# EAGLE design Hypex_PSU_v6 (EAGLE 6.5.0)
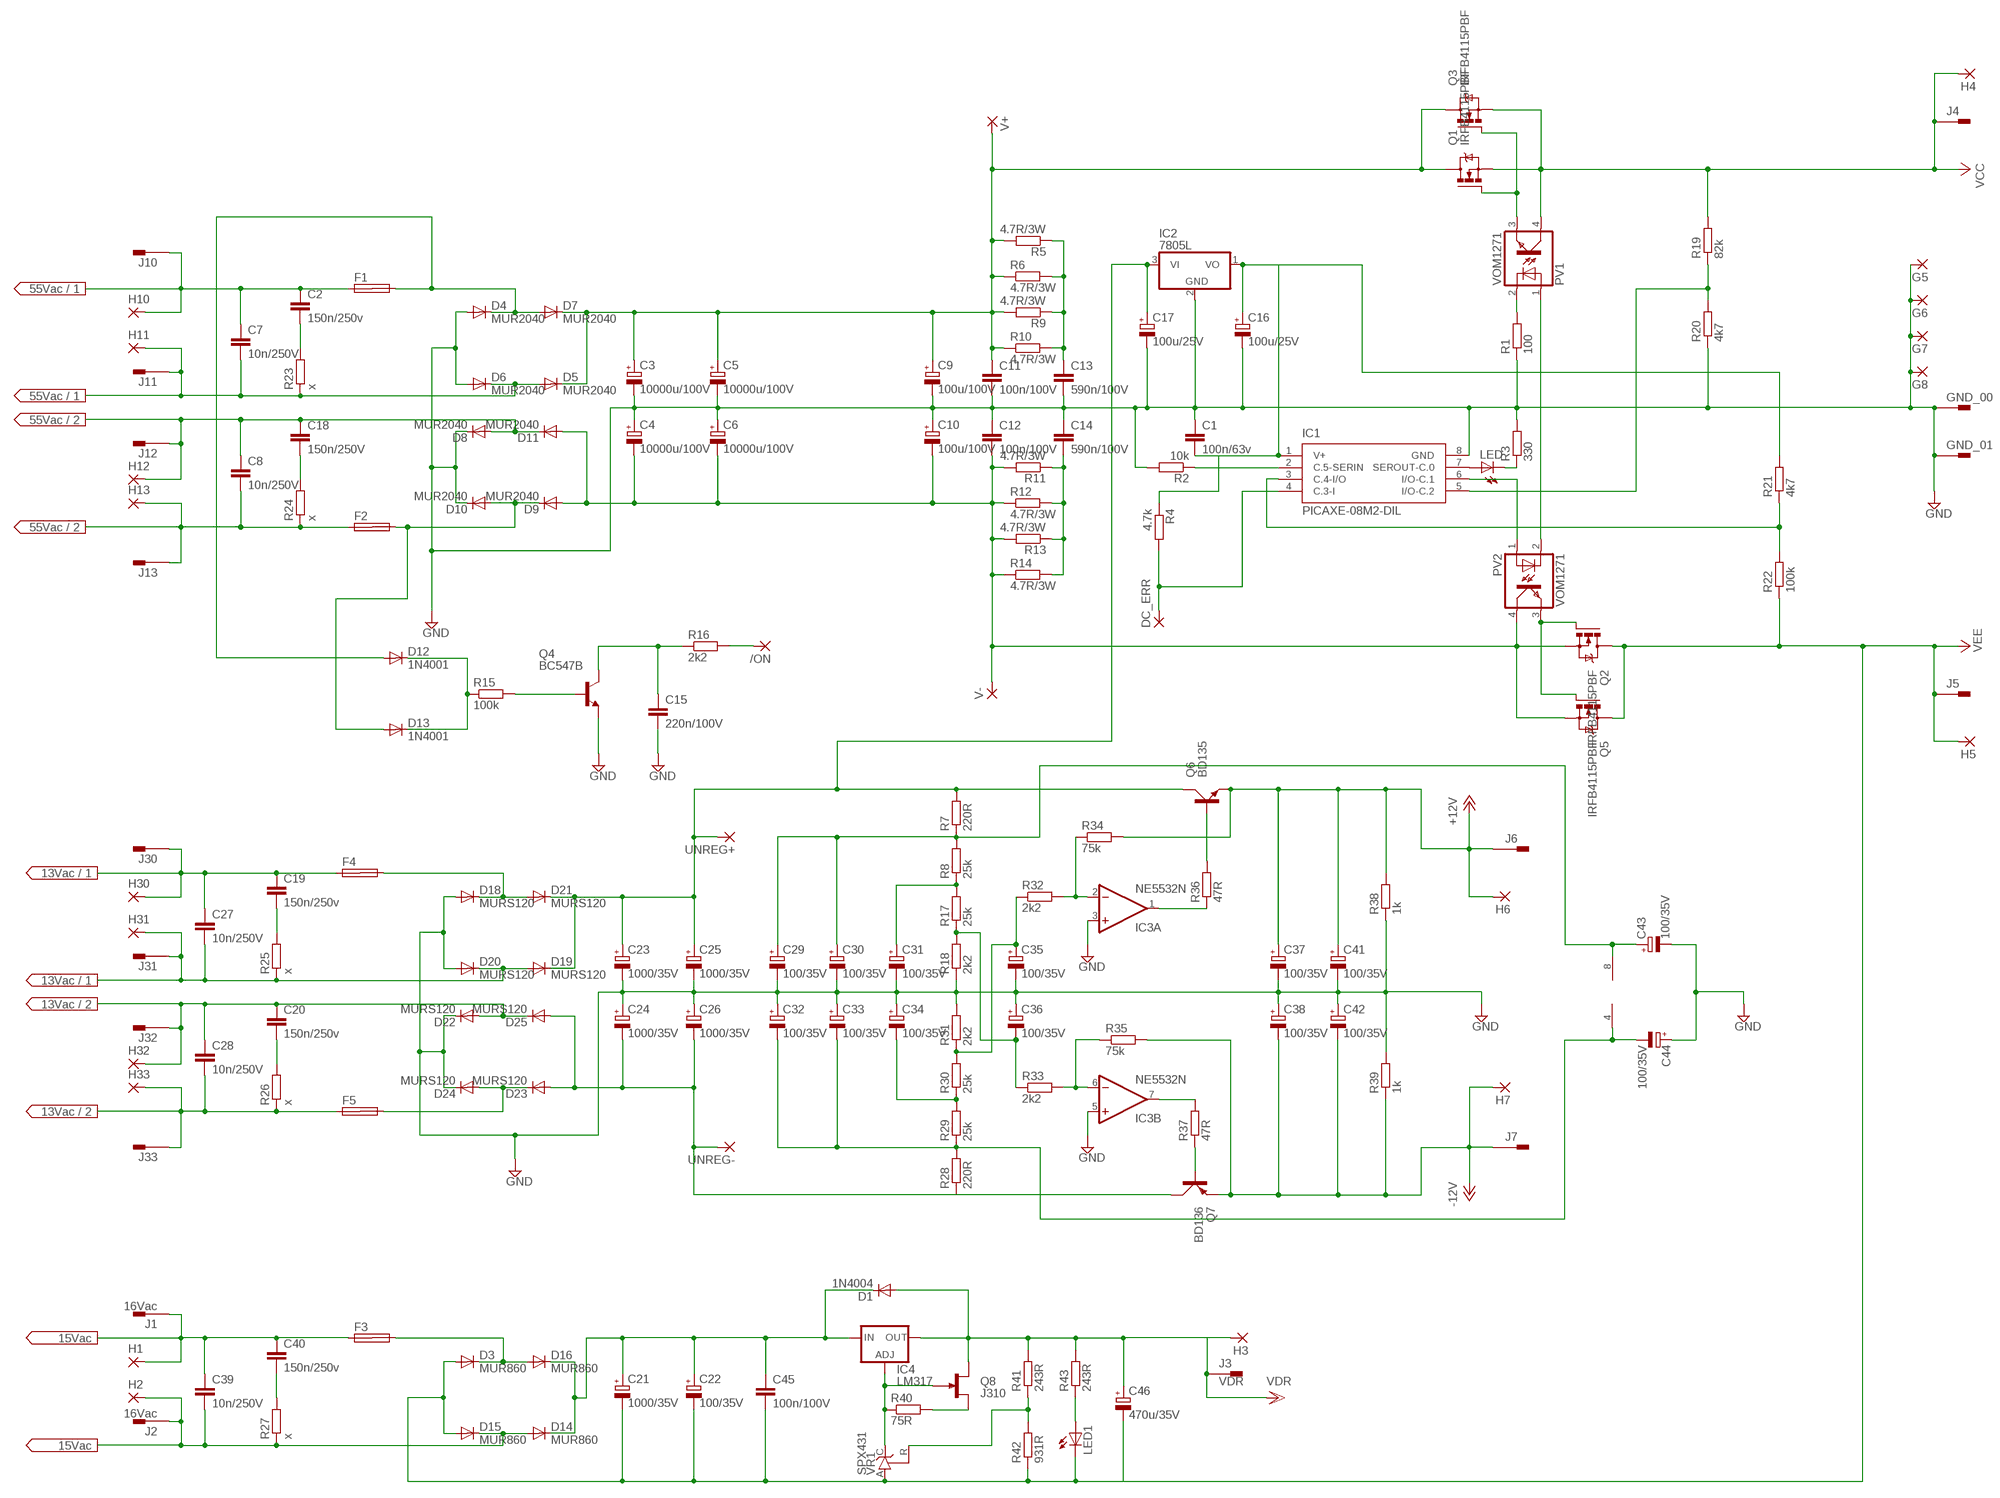
[diagram p0: schematic, sheet 1]

## Parts
/ON  2,54/0,8  [2,54/0,8]
C1  100n/63v  C-EU050-025X075  [C050-025X075]
C2  150n/250v  C-EU102-064X133  [C102-064X133]
C3  10000u/100V  CPOL-EUE10-35  [EB35D]
C4  10000u/100V  CPOL-EUE10-35  [EB35D]
C5  10000u/100V  CPOL-EUE10-35  [EB35D]
C6  10000u/100V  CPOL-EUE10-35  [EB35D]
C7  10n/250V  C-EU102-064X133  [C102-064X133]
C8  10n/250V  C-EU102-064X133  [C102-064X133]
C9  100u/100V  CPOL-EUE5-10.5  [E5-10,5]
C10  100u/100V  CPOL-EUE5-10.5  [E5-10,5]
C11  100n/100V  C-EU102-064X133  [C102-064X133]
C12  100n/100V  C-EU102-064X133  [C102-064X133]
C13  590n/100V  C-EU102-064X133  [C102-064X133]
C14  590n/100V  C-EU102-064X133  [C102-064X133]
C15  220n/100V  C-EU102-064X133  [C102-064X133]
C16  100u/25V  CPOL-EUE3.5-8  [E3,5-8]
C17  100u/25V  CPOL-EUE3.5-8  [E3,5-8]
C18  150n/250V  C-EU102-064X133  [C102-064X133]
C19  150n/250v  C-EU102-064X133  [C102-064X133]
C20  150n/250v  C-EU102-064X133  [C102-064X133]
C21  1000/35V  CPOL-EUE5-13  [E5-13]
C22  100/35V  CPOL-EUE5-8.5  [E5-8,5]
C23  1000/35V  CPOL-EUE5-13  [E5-13]
C24  1000/35V  CPOL-EUE5-13  [E5-13]
C25  1000/35V  CPOL-EUE5-13  [E5-13]
C26  1000/35V  CPOL-EUE5-13  [E5-13]
C27  10n/250V  C-EU102-064X133  [C102-064X133]
C28  10n/250V  C-EU102-064X133  [C102-064X133]
C29  100/35V  CPOL-EUE5-8.5  [E5-8,5]
C30  100/35V  CPOL-EUE5-8.5  [E5-8,5]
C31  100/35V  CPOL-EUE5-8.5  [E5-8,5]
C32  100/35V  CPOL-EUE5-8.5  [E5-8,5]
C33  100/35V  CPOL-EUE5-8.5  [E5-8,5]
C34  100/35V  CPOL-EUE5-8.5  [E5-8,5]
C35  100/35V  CPOL-EUE5-8.5  [E5-8,5]
C36  100/35V  CPOL-EUE5-8.5  [E5-8,5]
C37  100/35V  CPOL-EUE5-8.5  [E5-8,5]
C38  100/35V  CPOL-EUE5-8.5  [E5-8,5]
C39  10n/250V  C-EU102-064X133  [C102-064X133]
C40  150n/250v  C-EU102-064X133  [C102-064X133]
C41  100/35V  CPOL-EUE5-8.5  [E5-8,5]
C42  100/35V  CPOL-EUE5-8.5  [E5-8,5]
C43  100/35V  CPOL-EUE5-8.5  [E5-8,5]
C44  100/35V  CPOL-EUE5-8.5  [E5-8,5]
C45  100n/100V  C-EU102-064X133  [C102-064X133]
C46  470u/35V  CPOL-EUE5-8.5  [E5-8,5]
D1  1N4004  [DO41-10]
D3  MUR860  MUR810  [TO220ACS]
D4  MUR2040  MUR810  [TO220ACS]
D5  MUR2040  MUR810  [TO220ACS]
D6  MUR2040  MUR810  [TO220ACS]
D7  MUR2040  MUR810  [TO220ACS]
D8  MUR2040  MUR810  [TO220ACS]
D9  MUR2040  MUR810  [TO220ACS]
D10  MUR2040  MUR810  [TO220ACS]
D11  MUR2040  MUR810  [TO220ACS]
D12  1N4001  1N4004  [DO41-10]
D13  1N4001  1N4004  [DO41-10]
D14  MUR860  MUR810  [TO220ACS]
D15  MUR860  MUR810  [TO220ACS]
D16  MUR860  MUR810  [TO220ACS]
D18  MURS120  MUR810  [TO220ACS]
D19  MURS120  MUR810  [TO220ACS]
D20  MURS120  MUR810  [TO220ACS]
D21  MURS120  MUR810  [TO220ACS]
D22  MURS120  MUR810  [TO220ACS]
D23  MURS120  MUR810  [TO220ACS]
D24  MURS120  MUR810  [TO220ACS]
D25  MURS120  MUR810  [TO220ACS]
DC_ERR  2,54/0,8  [2,54/0,8]
F1  SHKOG  [SHKOG]
F2  SHKOG  [SHKOG]
F3  SHKOG  [SHKOG]
F4  SHKOG  [SHKOG]
F5  SHKOG  [SHKOG]
G5  3,17/1,3  [3,17/1,3]
G6  3,17/1,3  [3,17/1,3]
G7  3,17/1,3  [3,17/1,3]
G8  3,17/1,3  [3,17/1,3]
GND_00  PIN2F061.100  [F061.100]
GND_01  PIN2F061.100  [F061.100]
H1  3,81/1,4  [3,81/1,4]
H2  3,81/1,4  [3,81/1,4]
H3  3,81/1,4  [3,81/1,4]
H4  3,17/1,3  [3,17/1,3]
H5  3,17/1,3  [3,17/1,3]
H6  3,81/1,4  [3,81/1,4]
H7  3,81/1,4  [3,81/1,4]
H10  3,81/1,4  [3,81/1,4]
H11  3,81/1,4  [3,81/1,4]
H12  3,81/1,4  [3,81/1,4]
H13  3,81/1,4  [3,81/1,4]
H30  3,81/1,4  [3,81/1,4]
H31  3,81/1,4  [3,81/1,4]
H32  3,81/1,4  [3,81/1,4]
H33  3,81/1,4  [3,81/1,4]
IC1  PICAXE-08M2-DIL  [DIL8]
IC2  7805L  [TO92]
IC3  NE5532N  [DIL08]
IC4  LM317  LM317TS  [317TS]
J1  16Vac  PIN2F061.100  [F061.100]
J2  16Vac  PIN2F061.100  [F061.100]
J3  VDR  PIN2F061.100  [F061.100]
J4  PIN2F061.100  [F061.100]
J5  PIN2F061.100  [F061.100]
J6  PIN2F061.100  [F061.100]
J7  PIN2F061.100  [F061.100]
J10  PIN2F061.100  [F061.100]
J11  PIN2F061.100  [F061.100]
J12  PIN2F061.100  [F061.100]
J13  PIN2F061.100  [F061.100]
J30  PIN2F061.100  [F061.100]
J31  PIN2F061.100  [F061.100]
J32  PIN2F061.100  [F061.100]
J33  PIN2F061.100  [F061.100]
LED  LED3MM  [LED3MM]
LED1  LED3MM  [LED3MM]
PV1  VOM1271  LTV816S  [SMD4]
PV2  VOM1271  LTV816S  [SMD4]
Q1  IRFB4115PBF  IRF540  [TO220BV]
Q2  IRFB4115PBF  IRF540  [TO220BV]
Q3  IRFB4115PBF  IRF540  [TO220BV]
Q4  BC547B  [TO92]
Q5  IRFB4115PBF  IRF540  [TO220BV]
Q6  BD135  BD139  [TO126AV]
Q7  BD136  BD140  [TO126AV]
Q8  J310  [TO92R]
R1  100  R-EU_0207/10  [0207/10]
R2  10k  R-EU_0207/10  [0207/10]
R3  330  R-EU_0207/10  [0207/10]
R4  4.7k  R-EU_0207/10  [0207/10]
R5  4.7R/3W  R-EU_0617/5V  [0617V]
R6  4.7R/3W  R-EU_0617/5V  [0617V]
R7  220R  R-EU_0207/10  [0207/10]
R8  25k  R-EU_0207/10  [0207/10]
R9  4.7R/3W  R-EU_0617/5V  [0617V]
R10  4.7R/3W  R-EU_0617/5V  [0617V]
R11  4.7R/3W  R-EU_0617/5V  [0617V]
R12  4.7R/3W  R-EU_0617/5V  [0617V]
R13  4.7R/3W  R-EU_0617/5V  [0617V]
R14  4.7R/3W  R-EU_0617/5V  [0617V]
R15  100k  R-EU_0207/10  [0207/10]
R16  2k2  R-EU_0207/10  [0207/10]
R17  25k  R-EU_0207/10  [0207/10]
R18  2k2  R-EU_0207/10  [0207/10]
R19  82k  R-EU_0207/10  [0207/10]
R20  4k7  R-EU_0207/10  [0207/10]
R21  4k7  R-EU_0207/10  [0207/10]
R22  100k  R-EU_0207/10  [0207/10]
R23  x  R-EU_0207/7  [0207/7]
R24  x  R-EU_0207/7  [0207/7]
R25  x  R-EU_0207/10  [0207/10]
R26  x  R-EU_0207/10  [0207/10]
R27  x  R-EU_0207/10  [0207/10]
R28  220R  R-EU_0207/10  [0207/10]
R29  25k  R-EU_0207/10  [0207/10]
R30  25k  R-EU_0207/10  [0207/10]
R31  2k2  R-EU_0207/10  [0207/10]
R32  2k2  R-EU_0207/10  [0207/10]
R33  2k2  R-EU_0207/10  [0207/10]
R34  75k  R-EU_0207/10  [0207/10]
R35  75k  R-EU_0207/10  [0207/10]
R36  47R  R-EU_0207/10  [0207/10]
R37  47R  R-EU_0207/10  [0207/10]
R38  1k  R-EU_0207/10  [0207/10]
R39  1k  R-EU_0207/10  [0207/10]
R40  75R  R-EU_0207/10  [0207/10]
R41  243R  R-EU_0207/10  [0207/10]
R42  931R  R-EU_0207/10  [0207/10]
R43  243R  R-EU_0207/10  [0207/10]
UNREG+  3,81/1,4  [3,81/1,4]
UNREG-  3,81/1,4  [3,81/1,4]
V+  3,81/1,4  [3,81/1,4]
V-  3,81/1,4  [3,81/1,4]
VR1  SPX431  TL431CLP  [TO92-CLP]

## Nets
+12V: C37.+ C41.+ H6.1(P) J6.A1 J6.A2 Q6.E R34.2 R38.2
-12V: C38.- C42.- H7.1(P) J7.A1 J7.A2 Q7.E R35.2 R39.1
GND: C1.1 C3.- C4.+ C5.- C6.+ C9.- C10.+ C11.2 C12.1 C13.2 C14.1 C15.2 C16.- C17.- C23.- C24.+ C25.- C26.+ C29.- C30.- C31.- C32.+ C33.+ C34.+ C35.- C36.+ C37.- C38.+ C41.- C42.+ C43.- C44.+ D4.A D6.A D8.C D10.C D18.A D20.A D22.C D24.C G5.1(P) G6.1(P) G7.1(P) G8.1(P) GND_00.A1 GND_00.A2 GND_01.A1 GND_01.A2 IC1.8(GND) IC2.2(GND) IC3.3(A:+IN) IC3.5(B:+IN) Q4.1(E) R1.1 R2.2 R3.2 R18.1 R20.1 R31.2 R38.1 R39.2
N$1: C1.2 C16.+ IC1.1(V+) IC2.1(VO) R4.1 R21.2
N$2: DC_ERR.1(P) IC1.4(C.3-I) R4.2
N$3: PV1.3(EMIT) Q1.G Q3.G
N$4: PV1.1(A) PV2.2(C)
N$5: PV2.3(EMIT) Q2.G Q5.G
N$6: PV1.2(C) R1.2
N$7: IC1.6(I/O-C.1) PV2.1(A)
N$8: C27.2 D19.A D20.C H31.1(P) J31.A1 J31.A2 R25.1
N$9: C2.1 C7.1 F1.1A H10.1(P) J10.A1 J10.A2
N$10: IC1.5(I/O-C.2) R19.1 R20.2
N$11: C13.1 R5.1 R6.2 R9.1 R10.2
N$12: C20.1 C28.1 D22.A D25.C H32.1(P) J32.A1 J32.A2
N$13: C7.2 D5.A D6.C H11.1(P) J11.A1 J11.A2 R23.1
N$14: C14.2 R11.1 R12.2 R13.1 R14.2
N$15: D9.C D10.A D13.A F2.2A
N$16: C8.1 C18.1 D8.A D11.C H12.1(P) J12.A1 J12.A2
N$17: /ON.1(P) R16.2
N$18: C2.2 R23.2
N$19: D4.C D7.A D12.A F1.2A
N$20: C8.2 F2.1A H13.1(P) J13.A1 J13.A2 R24.1
N$21: IC1.2(C.5-SERIN) R2.1
N$22: IC1.7(SEROUT-C.0) LED.A
N$23: D12.C D13.C R15.1
N$24: Q4.2(B) R15.2
N$25: C15.1 Q4.3(C) R16.1
N$26: LED.K(C) R3.1
N$27: C18.2 R24.2
N$28: D23.C D24.A F5.2A
N$29: IC1.3(C.4-I/O) R21.1 R22.2
N$30: D18.C D21.A F4.2A
N$31: C19.2 R25.2
N$32: C20.2 R26.2
N$33: C40.2 R27.2
N$34: C36.- R17.1 R18.2 R33.1
N$35: C35.+ R30.2 R31.1 R32.1
N$36: C39.2 D14.A D15.C H2.1(P) J2.A1 J2.A2 R27.1
N$37: D3.C D16.A F3.2A
N$38: C39.1 C40.1 F3.1A H1.1(P) J1.A1 J1.A2
N$42: C19.1 C27.1 F4.1A H30.1(P) J30.A1 J30.A2
N$43: C31.+ R8.1 R17.2
N$44: C34.- R29.2 R30.1
N$45: C29.+ C30.+ C43.+ IC3.8(P:V+) R7.1 R8.2
N$46: C32.- C33.- C44.- IC3.4(P:V-) R28.2 R29.1
N$47: C21.+ C22.+ C45.1 D1.C D14.C D16.C IC4.3(IN)
N$48: IC3.1(A:OUT) R36.1
N$49: IC3.2(A:-IN) R32.2 R34.1
N$50: IC3.6(B:-IN) R33.2 R35.1
N$51: Q6.B R36.2
N$52: IC3.7(B:OUT) R37.2
N$53: Q7.B R37.1
N$54: C28.2 F5.1A H33.1(P) J33.A1 J33.A2 R26.1
N$55: IC4.1(ADJ) Q8.G R40.1 VR1.C
N$56: Q8.S R40.2
N$57: R41.1 R42.2 VR1.R
N$59: LED1.A R43.1
VCC: H4.1(P) J4.A1 J4.A2 PV1.4(COL) Q1.S Q3.S R19.2
VCC_IN: C3.+ C5.+ C9.+ C11.1 D5.C D7.C Q1.D Q3.D R5.2 R6.1 R9.2 R10.1 V+.1(P)
VCC_IN1: C17.+ C23.+ C25.+ D19.C D21.C IC2.3(VI) Q6.C R7.2 UNREG+.1(P)
VDD: C46.+ D1.A H3.1(P) IC4.2(OUT) J3.A1 J3.A2 Q8.D R41.2 R43.2 ; supply symbol labelled VDR
VEE: C21.- C22.- C45.2 C46.- D3.A D15.A H5.1(P) J5.A1 J5.A2 LED1.K(C) Q2.D Q5.D R22.1 R42.1 VR1.A
VEE_IN: C4.- C6.- C10.- C12.2 D9.A D11.A PV2.4(COL) Q2.S Q5.S R11.2 R12.1 R13.2 R14.1 V-.1(P)
VEE_IN1: C24.- C26.- D23.A D25.A Q7.C R28.1 UNREG-.1(P)
Unconnected: F1.1B F1.2B F2.1B F2.2B F3.1B F3.2B F4.1B F4.2B F5.1B F5.2B

## Library data of the parts
/ON DC_ERR = wirepad:2,54/0,8: THROUGH-HOLE PAD
C1 = rcl:C-EU: CAPACITOR, European symbol
C2 C7 C8 C11-C15 C18-C20 C27 C28 C39 C40 C45 = resistor:C-EU: CAPACITOR, European symbol
C3-C6 C9 C10 C16 C17 C21-C26 C29-C38 C41-C44 C46 = rcl:CPOL-EU: POLARIZED CAPACITOR, European symbol
D1 D12 D13 = diode:1N4004: DIODE general purpose rectifier, 1 A
D3-D11 D14-D16 D18-D25 = diode:MUR810: DIODE
F1-F5 = fuse:SHKOG: FUSE HOLDER 5 x 20/6 x 32 mm, SH contact, OG 46G6083 Buerklin; OC_FARNELL: unknown; OC_NEWARK: unknown
G5-G8 H4 H5 = wirepad:3,17/1,3: THROUGH-HOLE PAD
GND_00 GND_01 J1-J7 J10-J13 J30-J33 = con-faston:PIN2: Flachstecker Typ Tyco/Electronics/AMP TAB, FASTON Printed Circuit Board Tabs Source: http://www.buerklin.com, http://catalog.tycoelectronics.com; OC_FARNELL: unknown; OC_NEWARK: unknown
H1-H3 H6 H7 H10-H13 H30-H33 UNREG+ UNREG- V+ V- = wirepad:3,81/1,4: THROUGH-HOLE PAD
IC1 = PICAXE:PICAXE-08M2
IC2 = linear:78*: Positive VOLTAGE REGULATOR Source: http://cache.national.com/ds/LM/LM78L05.pdf http://www.fairchildsemi.com/ds/LM/LM7805.pdf
IC3 = linear:NE5532: AUDIO AMPLIFIER
IC4 = v-reg:LM317TS: VOLTAGE REGULATOR
LED LED1 = led:LED: LED OSRAM: - CHIPLED LG R971, LG N971, LY N971, LG Q971, LY Q971, LO R971, LY R971 LH N974, LH R974 LS Q976, LO Q976, LY Q976 LO Q996 - Hyper CHIPLED LW Q18S LB Q993, LB Q99A, LB R99A - SideLED LS A670, LO A670, LY A670, LG A670, LP A670 LB A673, LV A673, LT A673, LW A673 LH A674 LY A675 LS A676, LA A676, LO A676, LY A676, LW A676 LS A679, LY A679, LG A679 - Hyper Micro SIDELED® LS Y876, LA Y876, LO Y876, LY Y876 LT Y87S - SmartLED LW L88C, LW L88S LB L89C, LB L89S, LG L890 LS L89K, LO L89K, LY L89K LS L896, LA L896, LO L896, LY L896 - TOPLED LS T670, LO T670, LY T670, LG T670, LP T670 LSG T670, LSP T670, LSY T670, LOP T670, LYG T670 LG T671, LOG T671, LSG T671 LB T673, LV T673, LT T673, LW T673 LH T674 LS T676, LA T676, LO T676, LY T676, LB T676, LH T676, LSB T676, LW T676 LB T67C, LV T67C, LT T67C, LS T67K, LO T67K, LY T67K, LW E67C LS E67B, LA E67B, LO E67B, LY E67B, LB E67C, LV E67C, LT E67C LW T67C LS T679, LY T679, LG T679 LS T770, LO T770, LY T770, LG T770, LP T770 LB T773, LV T773, LT T773, LW T773 LH T774 LS E675, LA E675, LY E675, LS T675 LS T776, LA T776, LO T776, LY T776, LB T776 LHGB T686 LT T68C, LB T68C - Hyper Mini TOPLED® LB M676 - Mini TOPLED Santana® LG M470 LS M47K, LO M47K, LY M47K Source: http://www.osram.convergy.de LUXEON: - LUMILED® LXK2-PW12-R00, LXK2-PW12-S00, LXK2-PW14-U00, LXK2-PW14-V00 LXK2-PM12-R00, LXK2-PM12-S00, LXK2-PM14-U00 LXK2-PE12-Q00, LXK2-PE12-R00, LXK2-PE12-S00, LXK2-PE14-T00, LXK2-PE14-U00 LXK2-PB12-K00, LXK2-PB12-L00, LXK2-PB12-M00, LXK2-PB14-N00, LXK2-PB14-P00, LXK2-PB14-Q00 LXK2-PR12-L00, LXK2-PR12-M00, LXK2-PR14-Q00, LXK2-PR14-R00 LXK2-PD12-Q00, LXK2-PD12-R00, LXK2-PD12-S00 LXK2-PH12-R00, LXK2-PH12-S00 LXK2-PL12-P00, LXK2-PL12-Q00, LXK2-PL12-R00 Source: www.luxeon.com KINGBRIGHT: KA-3528ASYC Source: www.kingbright.com
PV1 PV2 = optocoupler:LTV816: OPTO COUPLER Source: LITEON, LTV816.pdf; OC_FARNELL: unknown; OC_NEWARK: unknown
Q1-Q3 Q5 = transistor-power:IRF540: HEXFET Power MOSFET
Q4 = transistor-npn:BC547*: NPN Transistor
Q6 = transistor-power:BD139: NPN TRANSISTOR
Q7 = transistor-power:BD140: PNP TRANSISTOR
Q8 = transistor-small-signal:J310: N-Channel RF Amplifier J309, J310 Source: http://www.fairchildsemi.com/pf/J3/J310.html
R1-R43 = resistor:R-EU_: RESISTOR, European symbol
VR1 = v-reg:TL431CLP: VOLTAGE REGULATOR

## Board
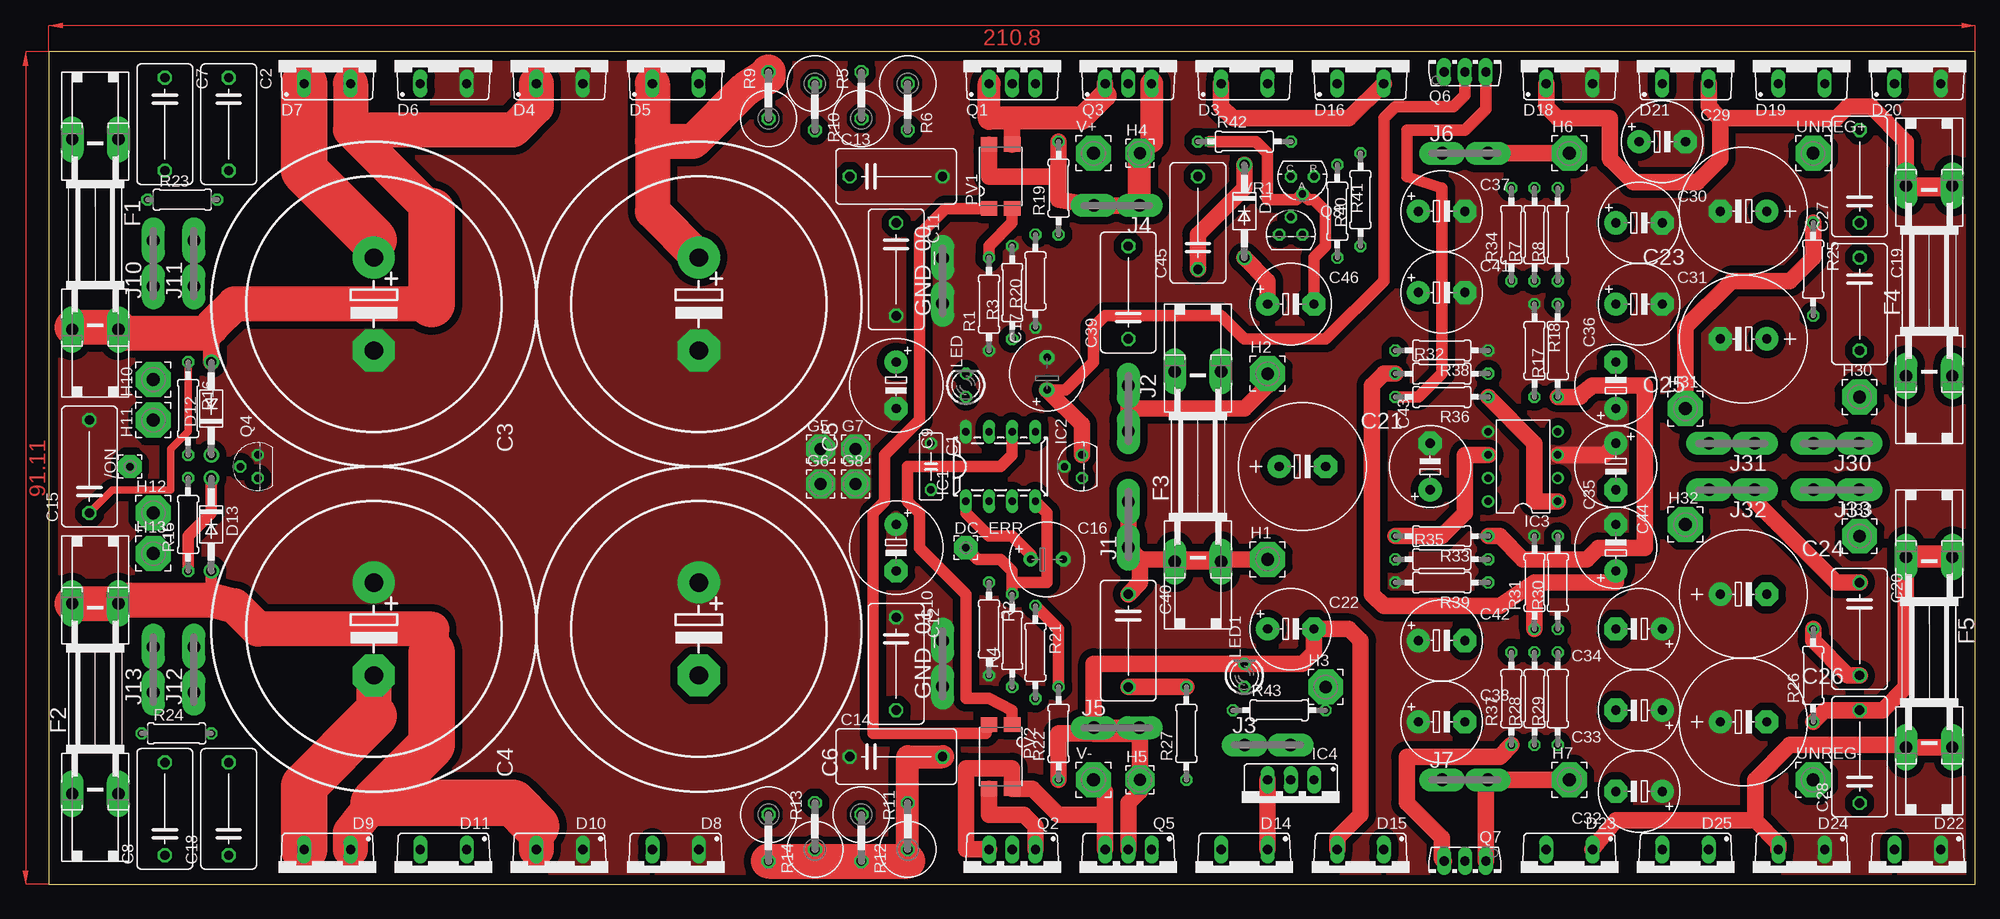
[diagram p1: board, top side]
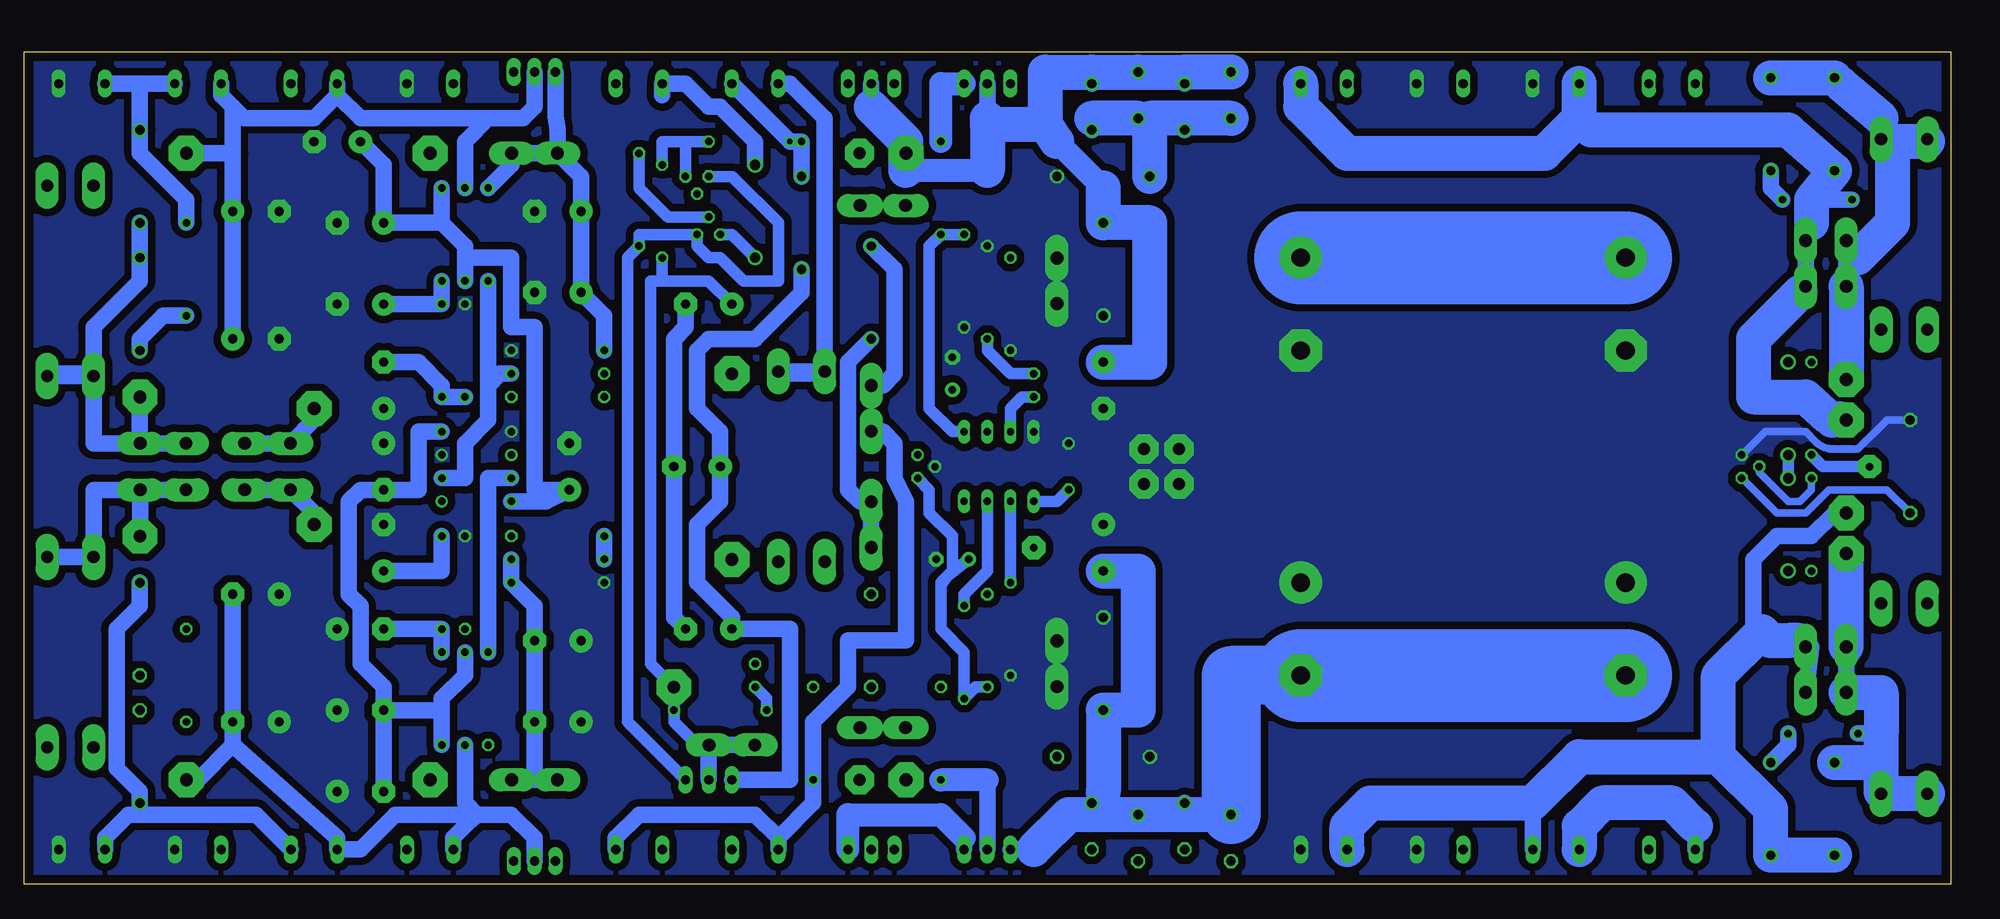
[diagram p2: board, bottom side, seen from below]

Size 210.8 x 91.11 mm. Coordinates in mm from the lower left corner, seen from the top.
Outline: 0,0 210.8,0 210.8,91.11 0,91.11 0,0
Copper layers (1*16): Top 0.035mm / dielectric 1.5mm / Bottom 0.035mm
Design rules "default": minimum track width 10mil, minimum drill 24mil, track to track 8mil, track to pad 8mil, pad to pad 8mil, via to via 8mil, smd to smd 8mil, copper to edge 40mil, drill to drill 8mil, minimum pad ring 10mil, minimum via ring 8mil, stop-mask expansion 4mil, vias tented up to drill 0mil, thermal gap 10mil

### Footprints (pad centres in the part's own frame; a part is rotated, then mirrored left to right if it is on the bottom)
2,54/0,8 = drill 0.813 pad 2.54 octagon: 1 0,0
C050-025X075 = drill 0.813 octagon: 1 -2.54,0; 2 2.54,0
C102-064X133 = drill 1.016 octagon: 1 -5.08,0; 2 5.08,0
EB35D = drill 2.007 pad 4.597: + -5.08,0 | drill 2.007 pad 4.597 octagon: - 5.08,0
E5-10,5 = drill 1.016 pad 2.54: + -2.54,0 | drill 1.016 pad 2.54 octagon: - 2.54,0
E3,5-8 = drill 0.813 pad 1.6: + -1.778,0 | drill 0.813 pad 1.6 octagon: - 1.778,0
E5-13 = drill 1.016 pad 2.54: + -2.54,0 | drill 1.016 pad 2.54 octagon: - 2.54,0
E5-8,5 = drill 1.016 pad 2.54: + -2.54,0 | drill 1.016 pad 2.54 octagon: - 2.54,0
DO41-10 = drill 1.118: A 5.08,0; C -5.08,0
TO220ACS = drill 1.016 long: A 2.54,-2.54; C -2.54,-2.54
SHKOG = drill 1.321 pad 2.54 long: 1A -10.414,2.54; 1B -10.414,-2.54; 2A 10.414,2.54; 2B 10.414,-2.54
3,17/1,3 = drill 1.321 pad 3.175 octagon: 1 0,0
F061.100 = drill 1.4 pad 2.54 long: A1 -2.5,0; A2 2.5,0
3,81/1,4 = drill 1.397 pad 3.81 octagon: 1 0,0
DIL8 = drill 0.8 pad 1.27 long: 1 -3.81,3.81; 2 -3.81,1.27; 3 -3.81,-1.27; 4 -3.81,-3.81; 5 3.81,-3.81; 6 3.81,-1.27; 7 3.81,1.27; 8 3.81,3.81
TO92 = drill 0.813 octagon: 1 -1.27,0; 2 0,1.905; 3 1.27,0
DIL08 = drill 0.813 pad 1.27: 1 -3.81,-3.81; 2 -1.27,-3.81; 3 1.27,-3.81; 4 3.81,-3.81; 5 3.81,3.81; 6 1.27,3.81; 7 -1.27,3.81; 8 -3.81,3.81
317TS = drill 1.016 long: 1 -2.54,-2.54; 2 0,-2.54; 3 2.54,-2.54
LED3MM = drill 0.813 octagon: A -1.27,0; K 1.27,0
SMD4 = smd 1.78 x 1.55: 1 -1.27,-3.5; 2 1.27,-3.5; 3 1.27,3.5; 4 -1.27,3.5
TO220BV = drill 1.016 long: D 0,-2.54; G -2.54,-2.54; S 2.54,-2.54
TO92' = drill 0.813 octagon: 1 1.27,0; 2 0,1.905; 3 -1.27,0
TO126AV = drill 1.016 long: B 2.286,-1.27; C 0,-1.27; E -2.286,-1.27
TO92R = drill 0.813 octagon: D -1.27,0; G 1.27,0; S 0,1.905
0207/10 = drill 0.813 octagon: 1 -5.08,0; 2 5.08,0
0617V = drill 1.016 octagon: 1 -2.54,0; 2 2.54,0
0207/7 = drill 0.813 octagon: 1 -3.81,0; 2 3.81,0
TO92-CLP = drill 0.813 octagon: A 0,1.905; C 1.27,0; R -1.27,0

### Placement (x,y rotation side)
/ON  8.89,45.72 90 top
C1  96.52,45.72 270 top
C2  19.68,83.19 270 top
C3  35.56,63.5 270 top
C4  35.56,27.94 270 top
C5  71.12,63.5 270 top
C6  71.12,27.94 270 top
C7  12.7,83.19 270 top
C8  12.7,8.25 90 top
C9  92.71,54.61 270 top
C10  92.71,36.83 270 top
C11  92.71,67.31 270 top
C12  92.71,24.13 270 top
C13  92.71,77.47 0 top
C14  92.71,13.97 0 top
C15  4.45,45.72 90 top
C16  109.22,35.56 0 top
C17  109.22,55.88 90 top
C18  19.68,8.25 90 top
C19  198.12,63.5 270 top
C20  198.12,27.94 270 top
C21  137.16,45.72 0 top
C22  135.89,27.94 0 top
C23  185.42,73.66 180 top
C24  185.42,31.75 0 top
C25  185.42,59.69 180 top
C26  185.42,17.78 0 top
C27  198.12,77.47 90 top
C28  198.12,13.97 90 top
C29  176.53,81.28 0 top
C30  173.99,72.39 0 top
C31  173.99,63.5 0 top
C32  173.99,10.16 180 top
C33  173.99,19.05 180 top
C34  173.99,27.94 180 top
C35  171.45,36.83 90 top
C36  171.45,54.61 90 top
C37  152.4,73.66 0 top
C38  152.4,17.78 0 top
C39  118.11,64.77 90 top
C40  118.11,26.67 270 top
C41  152.4,64.77 0 top
C42  152.4,26.67 0 top
C43  151.13,45.72 90 top
C44  171.45,45.72 270 top
C45  125.73,72.39 90 top
C46  135.89,63.5 0 top
D1  130.81,73.66 270 top
D3  130.81,90.17 0 top
D4  55.88,90.17 0 top
D5  68.58,90.17 0 top
D6  43.18,90.17 0 top
D7  30.48,90.17 0 top
D8  68.58,1.27 180 top
D9  30.48,1.27 180 top
D10  55.88,1.27 180 top
D11  43.18,1.27 180 top
D12  17.78,52.07 90 top
D13  17.78,39.37 270 top
D14  130.81,1.27 180 top
D15  143.51,1.27 180 top
D16  143.51,90.17 0 top
D18  166.37,90.17 0 top
D19  191.77,90.17 0 top
D20  204.47,90.17 0 top
D21  179.07,90.17 0 top
D22  204.47,1.27 180 top
D23  166.37,1.27 180 top
D24  191.77,1.27 180 top
D25  179.07,1.27 180 top
DC_ERR  100.33,36.83 0 top
F1  5.08,71.12 270 top
F2  5.08,20.32 90 top
F3  125.73,45.72 90 top
F4  205.74,66.04 90 top
F5  205.74,25.4 270 top
G5  84.45,47.62 0 top
G6  84.45,43.82 0 top
G7  88.27,47.62 0 top
G8  88.27,43.82 0 top
GND_00  97.79,66.04 90 top
GND_01  97.79,24.13 90 top
H1  133.35,35.56 0 top
H2  133.35,55.88 0 top
H3  139.7,21.59 0 top
H4  119.38,80.01 0 top
H5  119.38,11.43 0 top
H6  166.37,80.01 0 top
H7  166.37,11.43 0 top
H10  11.43,55.25 90 top
H11  11.43,50.8 90 top
H12  11.43,40.64 0 top
H13  11.43,36.2 0 top
H30  198.12,53.34 0 top
H31  179.07,52.07 0 top
H32  179.07,39.37 0 top
H33  198.12,38.1 0 top
IC1  104.14,45.72 90 top
IC2  113.03,45.72 90 top
IC3  161.29,45.72 90 top
IC4  135.89,8.89 180 top
J1  118.11,39.37 90 top
J2  118.11,52.07 270 top
J3  133.35,15.24 0 top
J4  116.84,74.3 180 top
J5  116.84,17.14 0 top
J6  154.94,80.01 0 top
J7  154.94,11.43 0 top
J10  11.43,67.94 90 top
J11  15.88,67.94 90 top
J12  15.88,23.49 90 top
J13  11.43,23.49 90 top
J30  195.58,48.26 180 top
J31  184.15,48.26 180 top
J32  184.15,43.18 180 top
J33  195.58,43.18 180 top
LED  100.33,54.61 90 top
LED1  130.81,22.86 90 top
PV1  104.14,77.47 0 top
PV2  104.14,13.97 180 top
Q1  105.41,90.17 0 top
Q2  105.41,1.27 180 top
Q3  118.11,90.17 0 top
Q4  BC547B  [TO92']  22.86,45.72 90 top
Q5  118.11,1.27 180 top
Q6  154.94,90.17 0 top
Q7  154.94,1.27 180 top
Q8  135.89,71.12 0 top
R1  102.87,63.5 90 top
R2  102.87,27.94 270 top
R3  105.41,64.77 90 top
R4  105.41,26.67 90 top
R5  88.9,86.36 90 top
R6  93.98,85.09 270 top
R7  162.56,71.12 90 top
R8  165.1,71.12 90 top
R9  78.74,86.36 90 top
R10  83.82,85.09 270 top
R11  93.98,6.35 90 top
R12  88.9,5.08 270 top
R13  83.82,6.35 90 top
R14  78.74,5.08 270 top
R15  15.24,39.37 90 top
R16  15.24,52.07 270 top
R17  165.1,58.42 90 top
R18  162.56,58.42 270 top
R19  110.49,76.2 90 top
R20  107.95,66.04 90 top
R21  107.95,25.4 270 top
R22  110.49,16.51 90 top
R23  14.61,74.93 0 top
R24  13.97,16.51 0 top
R25  193.04,67.31 270 top
R26  193.04,22.86 90 top
R27  124.46,16.51 90 top
R28  162.56,20.32 90 top
R29  165.1,20.32 90 top
R30  165.1,33.02 90 top
R31  162.56,33.02 90 top
R32  152.4,55.88 0 top
R33  152.4,38.1 180 top
R34  160.02,71.12 90 top
R35  152.4,35.56 0 top
R36  152.4,53.34 180 top
R37  160.02,20.32 90 top
R38  152.4,58.42 180 top
R39  152.4,33.02 180 top
R40  143.51,74.93 90 top
R41  140.97,73.66 270 top
R42  130.81,81.28 0 top
R43  134.62,19.05 0 top
UNREG+  193.04,80.01 0 top
UNREG-  193.04,11.43 0 top
V+  114.3,80.01 0 top
V-  114.3,11.43 0 top
VR1  137.16,77.47 180 top

### Tracks (layer width: path | path; a pad name or v marks a point on that pad's centre or on a via)
+12V
  Top 1.778: H6.1 J6.A2
  Bottom 1.778: Q6.E 152.65,84.07 152.44,82.59 J6.A1 | J6.A1 J6.A2 157.44,78.78 R34.2 | J6.A1 149.86,77.47 C37.+ C41.+ 147.32,62.23 R38.2
-12V
  Top 1.778: Q7.E 157.23,11.22 J7.A2 H7.1
  Bottom 1.778: R35.2 R39.1 154.94,30.48 C42.- C38.- 154.94,11.43 J7.A1 J7.A2
GND
  Top 1.778: IC3.3 170.07,46.99 arc45 170.25,47.06 C44.+
  Bottom 0.813: C15.2 6.88,50.8 arc-45 7.06,50.73 10.16,47.62 12.6,47.62 arc45 14.68,48.33 15.88,49.53 20.21,49.53 arc-45 20.39,49.46 Q4.1
  pour Bottom (isolate 0.813, no thermals): 0,90.8 210.57,90.8 arc-90 210.82,89.92 210.82,-0.63 0.25,0 arc-90 0,0.25
  pour Top (isolate 0.813, no thermals): 0,90.8 210.57,90.8 arc-90 210.82,89.92 210.82,-0.63 0.25,0 arc-90 0,0.25
N$1
  Top 1.27: C16.+ 107.44,36.07 105.41,38.1 102.87,38.1 100.33,40.64 IC1.1
  Bottom 1.27: IC1.1 97.79,41.91 C1.2 | R4.1 106.68,21.59 R21.2 107.95,25.4 110.49,27.94 110.49,33.02 | C16.+ 109.73,33.78 | 109.73,33.78 110.49,33.02 | IC2.1 111.76,43.18 111.76,40.64 109.22,38.1 109.22,34.29 109.73,33.78 | 110.49,33.02 110.24,33.02 109.73,33.78
N$2
  Top 1.27: DC_ERR.1 101.6,35.56 104.14,35.56 105.41,34.29 105.41,33.02 | IC1.4 109.22,40.64 109.22,33.02 105.41,33.02 | 105.41,33.02 R4.2
N$3
  Top 1.778: PV1.3 105.41,83.82 | Q3.G 115.57,86.36
  Top 2.54: Q1.G 102.87,83.82 105.41,83.82 113.03,83.82 115.57,86.36
N$4
  Top 1.27: PV1.1 98.1,73.97 95.25,71.12 95.25,50.8 91.44,46.99 91.44,41.91 90.17,40.64 90.17,16.51 102.56,16.51 PV2.2
N$5
  Top 1.778: PV2.3 102.87,7.62 106.68,7.62 107.95,6.35 Q2.G
  Bottom 1.778: 107.95,5.08 Q2.G
  Bottom 2.54: Q5.G 120.65,7.62 110.49,7.62 107.95,5.08
N$6
  Top 1.27: R1.2 102.87,69.85 105.41,72.39 PV1.2
N$7
  Top 1.27: IC1.6 105.41,46.99 104.14,45.72 93.98,45.72 93.98,41.91 95.25,40.64 95.25,36.83 100.33,31.75 100.33,20.32 102.87,20.32 105.41,19.05 PV2.1
N$8
  Top 1.778: R25.1 193.04,68.58 190.5,66.04 184.15,66.04 179.07,60.96 H31.1
  Bottom 1.778: D19.A 198.12,87.63 | 198.12,87.63 D20.C | 198.12,87.63 C27.2 198.12,80.01 193.04,74.93 R25.1 | H31.1 179.07,50.84 J31.A2 J31.A1
N$9
  Bottom 1.778: C7.1 12.07,87.63 | 7.62,83.82 F1.1A 2.79,81.53 2.54,81.28 | 6.35,81.28 7.62,81.28 | J10.A1 J10.A2 10.2,68.54
  Bottom 3.81: C2.1 C7.1 | 12.07,87.63 7.62,83.82 | 2.54,81.28 6.35,81.28 6.35,72.39 10.2,68.54 | J10.A1 H10.1
N$10
  Bottom 1.27: R20.2 R19.1 111.76,69.85 111.76,52.07 109.22,49.53 IC1.5
N$11
  Bottom 1.778: R10.2 83.82,83.82 | 87.63,83.82 R5.1 | 93.98,83.82 R6.2
  Bottom 3.81: R9.1 83.82,83.82 87.63,83.82 C13.1 | R5.1 93.98,83.82
N$12  (1 unrouted)
  Top 1.778: J32.A1 186.65,41.95 195.58,33.02 C20.1
  Bottom 1.778: D25.C 185.42,7.62 198.12,7.62 | 198.12,7.62 199.39,7.62 201.93,5.08 D22.A | 198.12,7.62 C28.1 198.12,10.16 200.66,12.7 200.66,27.94 198.12,30.48 C20.1 | J32.A1 181.61,43.18 179.07,40.64 H32.1
N$13
  Bottom 1.778: 15.24,74.93 R23.1 | 39.37,82.55 40.64,83.82 | 15.24,72.39 J11.A2 J11.A1 16.47,64.81
  Bottom 3.81: D5.A 71.12,85.09 66.04,80.01 44.45,80.01 40.64,83.82 D6.C | 39.37,82.55 17.78,82.55 C7.2 15.24,74.93 15.24,72.39 | 16.47,64.81 21.59,59.69 21.59,53.34 15.88,53.34 13.34,51.05 11.88,50.87 arc-45 12.98,50.8 H11.1
N$14
  Top 1.778: R13.1 83.82,2.54 | 93.98,2.54 R11.1
  Top 2.54: R11.1 93.98,13.97 C14.2
  Top 3.81: R14.2 83.82,2.54 R12.2 93.98,2.54
N$15
  Top 1.27: D13.A 17.78,31.11
  Top 1.778: 7.37,30.73 7.62,31.11
  Top 3.81: D9.C 33.02,5.72 35.56,8.89 | 53.34,6.35 D10.A | 41.91,25.4 41.91,27.94 22.86,27.94 20.32,30.48 17.78,31.11 7.62,31.11 | F2.2A 7.37,30.73
  Top 5.08: 53.34,6.35 50.8,8.89 35.56,8.89 41.91,15.24 41.91,25.4
N$16
  Bottom 1.778: D11.C 45.72,8.89 | H12.1 12.7,40.64 15.24,38.1 19.05,38.1 21.59,35.56 21.59,28.57 20.64,27.62 | 16.55,26.67 J12.A2 | J12.A1 15.24,26.04 17.78,26.67
  Bottom 3.81: 25.4,13.97 40.64,13.97 45.72,8.89 63.5,8.89 66.04,6.35 D8.A | 25.4,13.97 19.68,8.25 C18.1 C8.1 | 16.55,26.67 17.78,26.67 19.68,26.67 20.64,27.62 25.4,22.86 25.4,13.97
N$17
  Bottom 1.27: R16.2 13.97,45.72 /ON.1
N$18
  Bottom 1.778: C2.2 19.68,76.2 R23.2
N$19
  Top 1.778: F1.2A 8,60.71 arc-90 8.26,60.45 8.26,60.32 7.62,60.32 | 17.14,60.32 arc-90 16.89,60.07 16.76,60.07 17.78,60.96 D12.A
  Top 3.81: D7.A 33.02,82.55 | 33.02,82.55 41.91,73.66 | 41.91,63.5 20.32,63.5 17.78,60.96 | D4.C 53.34,85.09 50.8,82.55 33.02,82.55 | 8.26,60.32 17.14,60.32
  Top 5.08: 41.91,73.66 41.91,63.5
N$20
  Bottom 1.778: 7.37,9.91 7.62,10.16 | 7.62,16.51 R24.1 | 7.66,20.99 7.62,20.95 | J13.A1 J13.A2
  Bottom 3.81: F2.1A 7.37,9.91 | 7.62,10.16 7.62,13.33 | 7.62,13.33 7.62,16.51 7.62,20.95 | C8.2 7.62,13.33 | J13.A1 7.66,20.99 | J13.A2 H13.1
N$21
  Bottom 1.27: IC1.2 R2.1
N$22
  Bottom 1.27: LED.A 101.6,53.34 102.87,52.07 IC1.7
N$23
  Top 1.27: R15.1 15.24,38.1 17.78,40.64 D13.C
  Bottom 1.27: D12.C D13.C
N$24
  Bottom 0.813: Q4.2 20.95,45.09 17.78,41.91 16.51,41.91 15.24,43.18 R15.2
N$25
  Top 0.813: R16.1 15.24,49.64 arc-45 15.17,49.46 13.34,47.62 13.34,43.18 7.09,43.18 arc45 6.91,43.11 C15.1
  Bottom 0.813: Q4.3 19.05,40.64 15.88,40.64 13.34,43.18 6.98,43.18 C15.1
N$26
  Bottom 1.27: R3.1 105.41,58.42 102.87,55.88 LED.K
N$27
  Bottom 1.778: R24.2 17.78,15.24 C18.2
N$28
  Top 1.778: D23.C 171.45,6.99 186.69,6.99 | 186.69,6.99 189.23,4.44 D24.A | F5.2A 203.45,14.99 203.2,15.24 190.5,15.24 186.69,11.43 186.69,6.99
N$29
  Top 1.27: R21.1 110.49,27.94 R22.2
  Bottom 1.27: IC1.3 105.41,34.29 107.95,31.75 R21.1
N$30
  Top 1.778: D18.C 163.83,85.09 165.1,83.82 170.81,83.82 170.81,79.48 arc45 170.89,79.3 173.35,76.83 180.24,76.83 arc45 180.41,76.91 182.88,79.38 182.88,83.71 arc45 182.81,83.89 | 182.81,83.89 182.88,83.82 195.58,83.82 196.85,85.09 199.39,85.09 203.2,81.28 203.2,76.2 208.28,76.2 208.03,76.45 F4.2A | D21.A 181.61,85.09 182.56,84.14 182.81,83.89
N$31
  Bottom 1.778: R25.2 195.58,62.23 198.12,59.69 C19.2
N$32
  Top 1.778: R26.2 193.04,26.67 196.85,22.86 C20.2
N$33
  Top 1.778: C40.2 R27.2
N$34
  Top 1.778: R33.1 158.75,38.1 161.29,35.56 168.28,35.56 169.55,36.83 174.62,36.83 174.62,54.61 168.91,54.61 167.64,53.59 arc-90 167.39,53.34 R17.1
  Bottom 1.778: R18.2 R17.1 165.1,54.61 167.64,57.15 C36.-
N$35
  Top 1.778: R32.1 146.05,55.88 144.78,54.61 144.78,31.75 146.05,30.48 158.75,30.48 162.56,33.02 | 162.56,33.02 171.45,33.02 C35.+ | R31.1 162.56,33.02
  Bottom 1.778: C35.+ 165.1,34.29 R30.2
N$36
  Top 1.778: H2.1 133.35,54.61 130.81,52.07 118.11,52.07 | 118.11,52.07 J2.A1 | J2.A2 118.11,52.07
  Bottom 1.778: 128.27,5.08 124.46,8.89 R27.1 124.46,17.78 120.65,21.59 120.65,26.67 114.3,26.67 114.3,41.91 115.57,44.45 115.57,48.26 116.84,49.53 | 116.8,49.53 116.84,49.53 | 116.84,49.53 J2.A2 | D14.A 128.27,5.08 | 128.27,5.08 130.81,7.62 143.51,7.62 146.05,5.08 D15.C | J2.A1 116.84,54.61 115.57,55.88 115.57,67.31 C39.2
N$37
  Top 1.778: D3.C 128.27,85.09 129.54,83.82 142.24,83.82 D16.A
  Bottom 1.778: F3.2A 128.02,56.13 128.27,55.88 123.19,55.88 123.19,83.82 127,87.63 D3.C
N$38
  Top 1.778: C40.1 119.38,33.02 119.38,35.56 | 119.38,35.56 J1.A1 | F3.1A 128.02,35.31 128.27,35.56 | 128.27,35.56 119.38,35.56 | H1.1 128.27,35.56
  Bottom 1.778: C39.1 120.65,57.15 120.65,43.18 119.34,41.91 J1.A2 J1.A1
N$39
  Top 3.81: 2.54,60.96 7.62,60.96
N$40
  Top 1.778: 118.11,41.91 118.11,36.2
N$42
  Bottom 1.778: C27.1 C19.1 198.12,66.04 203.2,60.96 203.2,55.88 | 203.2,55.88 F4.1A | J30.A1 203.2,48.26 F4.1A | J30.A1 J30.A2 | H30.1 198.12,48.3 J30.A1 | F4.1A 208.28,55.63 208.28,55.88 203.2,55.88
N$43
  Bottom 1.778: R8.1 R17.2 C31.+
N$44
  Bottom 1.778: R29.2 R30.1 C34.-
N$45
  Bottom 1.778: IC3.8 153.67,41.91 C43.+ 154.94,43.18 154.94,60.96 157.48,60.96 157.48,68.58 162.56,68.58 | R7.1 162.56,68.58 | 162.56,68.58 162.56,69.85 165.1,72.39 | 165.1,72.39 R8.2 | 165.1,72.39 C30.+ 171.45,78.74 C29.+
N$46
  Bottom 1.778: IC3.4 167.64,49.53 167.64,43.18 C44.- 173.99,43.18 175.26,41.91 175.26,31.75 173.99,30.48 173.99,24.13 171.45,21.59 C33.- | R28.2 162.56,22.86 165.1,20.32 165.1,19.05 | 165.1,19.05 R29.1 | C33.- 165.1,19.05 | C32.- C33.-
N$47
  Top 1.778: D1.C 130.81,76.2 125.73,71.12 C45.1 | D14.C IC4.3
  Bottom 1.778: 140.97,86.36 D16.C 138.43,87.63 135.89,85.09 134.62,85.09 130.81,81.28 D1.C | C45.1 125.73,64.77 130.81,59.69 135.89,59.69 137.16,58.42 137.16,52.07 134.62,49.53 C21.+ 134.62,41.91 137.16,39.37 137.16,33.02 133.35,29.21 C22.+ 127,27.94 127,11.43 IC4.3
N$48
  Top 1.778: R36.1 162.56,48.26 162.56,41.91 IC3.1
N$49
  Bottom 1.778: R32.2 158.75,55.88 160.02,54.61 | 160.02,54.61 160.02,50.8 162.56,48.26 162.56,44.45 IC3.2 | R34.1 160.02,54.61
N$50
  Top 1.778: R33.2 152.4,38.1 154.94,40.64 154.94,46.99 IC3.6
  Bottom 1.778: R33.2 R35.1
N$51
  Top 1.27: Q6.B 157.23,84.84 154.94,82.55 148.59,82.55 148.59,77.47 152.4,76.2 152.4,55.88 149.86,53.34 R36.2
N$52
  Bottom 1.778: IC3.7 160.02,44.45 R37.2
N$53
  Top 1.778: R37.1 158.75,13.97 148.59,13.97 148.59,8.89 152.4,5.08 152.4,2.79 Q7.B
N$54  (via drill 0.6)
  Top 1.778: 203.84,36.2 208.03,36.2 arc-90 208.28,35.94 208.28,35.56 v203.2,35.56 203.2,21.59 200.66,19.05 C28.2 194.31,19.05 R26.1
  Bottom 1.778: J33.A2 J33.A1 | J33.A1 198.08,38.14 H33.1 | F5.1A 203.45,35.81 v203.2,35.56 203.2,43.18 J33.A1
N$55
  Bottom 1.27: VR1.C 133.35,77.47 128.27,72.39 128.27,66.04 132.08,66.04 134.62,68.58 135.89,68.58 137.16,69.85 Q8.G 143.51,71.12 R40.1 144.78,68.58 144.78,17.78 IC4.1
N$56
  Bottom 1.27: Q8.S 140.34,73.02 143.51,76.2 R40.2
N$57
  Bottom 1.27: 138.43,81.28 R42.2 | VR1.R 138.43,81.28 | R41.1 140.97,81.28 138.43,81.28
N$59
  Bottom 1.27: R43.1 129.54,20.32 LED1.A
VCC
  Top 1.778: PV1.4 102.87,77.47 110.49,77.47 | 110.49,77.47 R19.2 | 110.49,77.47 110.49,74.93 J4.A2 J4.A1 | 119.34,79.97 H4.1 120.65,81.28
  Top 2.54: Q3.S 120.65,81.28 | J4.A1 119.34,79.97
  Bottom 2.54: R19.2 110.49,87.63 Q1.S
VCC_IN
  Top 3.81: 35.56,70.48 C3.+ | D5.C 66.04,81.28 | 66.04,81.28 66.04,73.66 C5.+ | R9.2 78.36,88.27 arc90 78.74,88.65 76.2,86.99 70.48,81.28 66.04,81.28
  Top 5.08: D7.C 27.94,78.1 35.56,70.48
  Bottom 1.778: Q1.D 105.41,83.82 105.41,83.19 | V+.1 114.3,81.28 | 118.11,85.09 Q3.D | 83.82,88.9 R10.1 | R6.1 93.98,88.9
  Bottom 10.16: C5.+ C3.+
  Bottom 2.54: 92.71,76.2 97.79,81.28 | 105.41,78.1 114.3,78.1
  Bottom 3.81: C9.+ 87.63,57.15 87.63,72.39 C11.1 92.71,76.2 | 97.79,81.28 99.06,83.19 | 99.06,83.19 99.06,88.9 93.98,88.9 R5.2 83.82,88.9 R9.2 | 105.41,83.19 99.06,83.19 | 105.41,83.82 105.41,78.1 | 114.3,78.1 V+.1 | 114.3,81.28 118.11,85.09
VCC_IN1
  Top 1.27: C17.+ 111.25,54.1 114.3,57.15 114.3,60.96 115.57,62.23 128.27,62.23 130.81,59.69 139.7,59.69 146.05,66.04 146.05,83.82 147.32,85.09 153.67,85.09 154.94,86.36 Q6.C
  Top 1.778: IC2.3 113.03,50.29 C17.+
  Bottom 1.778: R7.2 162.56,81.28 160.02,83.82 | 160.02,83.82 156.21,83.82 154.94,85.09 Q6.C | 176.53,86.36 173.99,83.82 160.02,83.82 | D21.C 176.53,86.36 | 176.53,86.36 179.07,83.82 186.69,83.82 187.96,85.09 | 187.96,85.09 189.23,86.36 D19.C | C25.+ C23.+ 187.96,80.01 | UNREG+.1 187.96,80.01 | 187.96,80.01 187.96,85.09
VDD
  Top 1.778: D1.A 133.35,66.04 C46.+
  Bottom 1.27: Q8.D 133.35,71.12 D1.A | 140.97,66.04 142.24,66.04 142.24,24.13 H3.1 R43.2 139.7,17.78 137.16,15.24 135.89,15.24 | 140.97,66.04 135.89,66.04 C46.+ | R41.2 140.97,66.04
  Bottom 1.778: IC4.2 135.89,15.24 J3.A2 J3.A1
VEE  (via drill 0.6)
  Top 1.27: v127,81.28 132.08,81.28 133.35,80.01 133.35,74.93 136.53,74.93 VR1.A 137.8,74.93 138.43,74.93 139.7,73.66 139.7,69.85 138.43,68.58 C46.-
  Top 1.778: Q5.D 118.11,8.89 119.38,10.16 H5.1 119.38,16.47 | 119.38,16.47 J5.A2 J5.A1 114.3,16.51 | 114.3,16.51 110.49,16.51 R22.1 | 119.38,16.47 114.34,16.47 114.3,16.51 | 114.3,16.51 114.3,24.13 LED1.K 137.16,24.13 138.43,25.4 C22.- 142.24,27.94 143.51,26.67 143.51,7.62 140.97,5.08 D15.A
  Bottom 1.778: Q2.D 105.41,11.43 | D3.A v127,81.28 R42.1 C45.2 | C46.- 138.43,60.96 139.7,59.69 C21.- 139.7,29.21 C22.-
  Bottom 2.54: 105.41,11.43 R22.1
VEE_IN
  Top 1.778: 115.57,7.62 110.49,7.62 107.64,10.47 PV2.4 105.41,12.7 100.33,12.7 100.33,3.81 Q2.S | 115.57,7.62 Q5.S | V-.1 115.57,10.16 115.57,7.62
  Top 3.81: C4.- 35.56,18.41
  Top 5.08: 35.56,18.41 27.94,10.79 D9.A
  Bottom 1.778: D9.A 27.94,6.35 | 92.71,10.16 R11.2 93.98,7.62 | R13.2 83.82,7.62 | 100.33,3.81 Q2.S
  Bottom 10.16: C6.- C4.-
  Bottom 3.81: 27.94,6.35 30.48,8.89 38.1,8.89 40.64,6.35 D11.A | 92.71,10.16 C12.2 88.9,19.05 88.9,34.29 C10.- | R14.1 83.82,7.62 R12.1 93.98,7.62 96.52,7.62 100.33,3.81
  Bottom 6.452: C6.- 78.74,22.86 R14.1
VEE_IN1
  Bottom 1.778: Q7.C 154.94,5.08 157.48,7.62 161.29,7.62 | 161.29,7.62 162.56,8.89 R28.1 | D23.A 163.83,5.08 161.93,6.99 | 161.93,6.99 161.29,7.62 | 161.93,6.99 162.56,7.62 170.18,7.62 173.99,3.81 D25.A 176.53,5.08 187.96,15.24 | C24.- C26.- 187.96,15.24 | UNREG-.1 191.77,11.43 187.96,15.24
(copper drawn outside any net)
  shapes: Top area x2